# Altium schematic sheet TempSensors.SchDoc
size A4; SheetNumber: 6; SheetTotal: 12
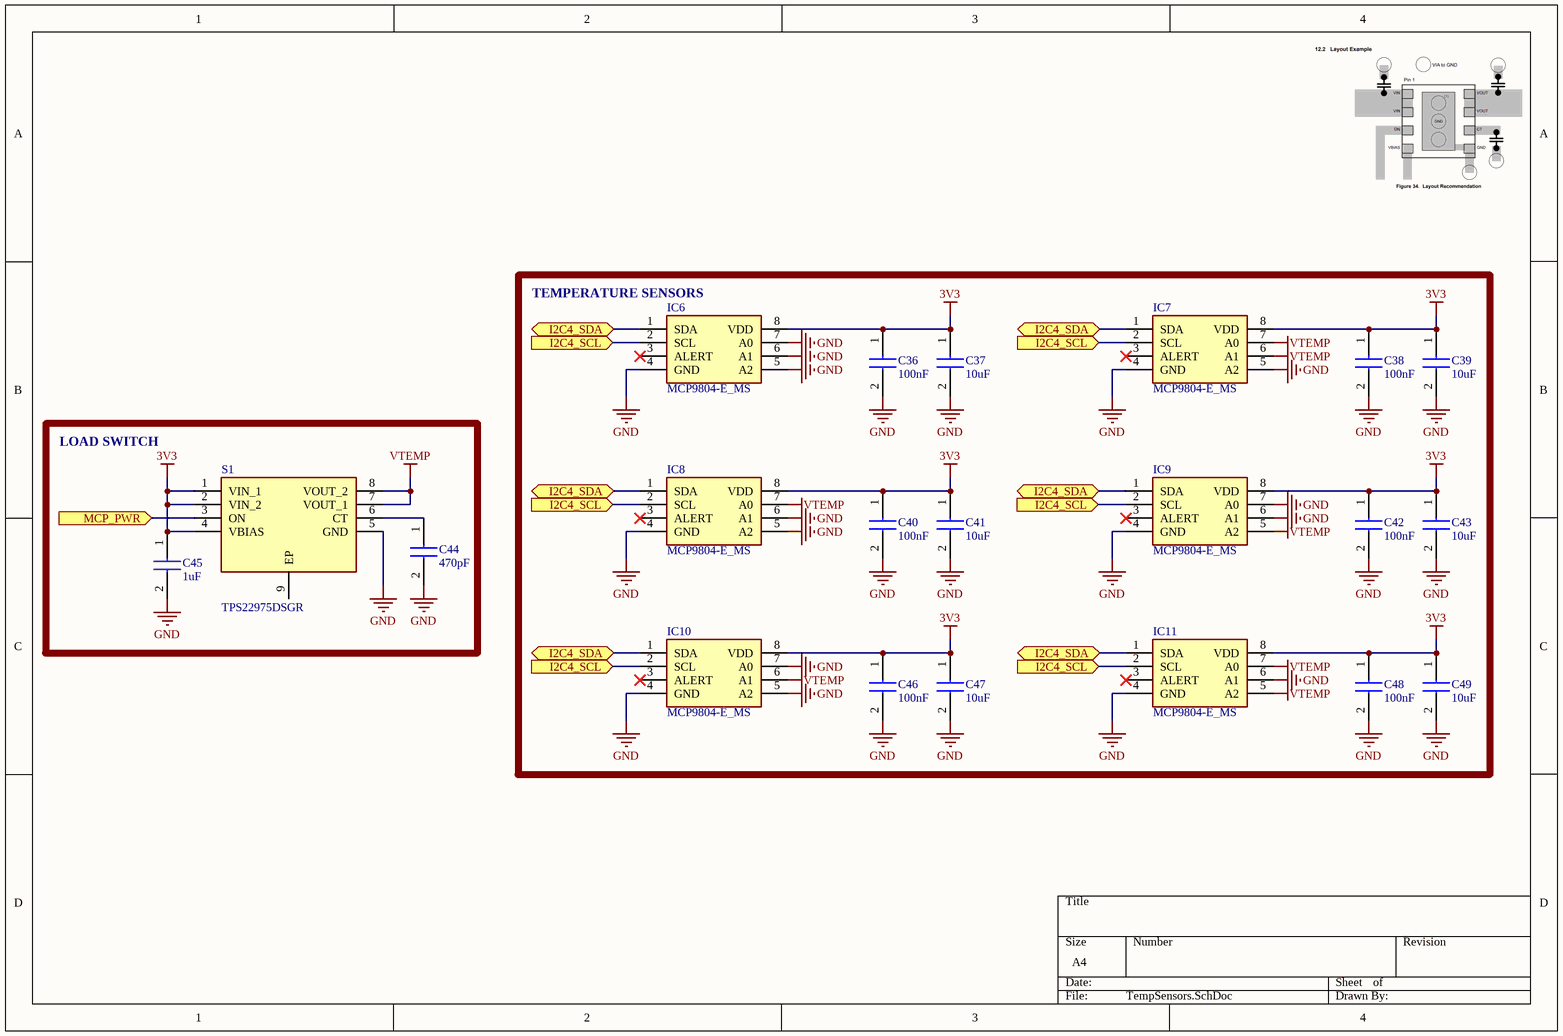
[diagram p0: TempSensors.SchDoc]

## Parts
C36  100nF  [CAPC1608X95N]
C37  10uF  [CAPC1608X90N]
C38  100nF  [CAPC1608X95N]
C39  10uF  [CAPC1608X90N]
C40  100nF  [CAPC1608X95N]
C41  10uF  [CAPC1608X90N]
C42  100nF  [CAPC1608X95N]
C43  10uF  [CAPC1608X90N]
C44  470pF  [CAPC1608X87N]
C45  1uF  [CAPC1608X90N]
C46  100nF  [CAPC1608X95N]
C47  10uF  [CAPC1608X90N]
C48  100nF  [CAPC1608X95N]
C49  10uF  [CAPC1608X90N]
IC6  MCP9804-E_MS  [SOP65P490X110-8N]
IC7  MCP9804-E_MS  [SOP65P490X110-8N]
IC8  MCP9804-E_MS  [SOP65P490X110-8N]
IC9  MCP9804-E_MS  [SOP65P490X110-8N]
IC10  MCP9804-E_MS  [SOP65P490X110-8N]
IC11  MCP9804-E_MS  [SOP65P490X110-8N]
S1  TPS22975DSGR  [SON50P200X200X80-9N]

## Blocks framed on the sheet
TEMPERATURE SENSORS: C36-C43 C46-C49 IC6-IC11
LOAD SWITCH: C44 C45 S1

## Ports
I2C4_SCL (in), I2C4_SDA (bidir), MCP_PWR (in)

## Nets
3V3: C36.1 C37.1 C38.1 C39.1 C40.1 C41.1 C42.1 C43.1 C45.1 C46.1 C47.1 C48.1 C49.1 IC6.8(VDD) IC7.8(VDD) IC8.8(VDD) IC9.8(VDD) IC10.8(VDD) IC11.8(VDD) S1.1(VIN_1) S1.2(VIN_2) S1.4(VBIAS)
GND: C36.2 C37.2 C38.2 C39.2 C40.2 C41.2 C42.2 C43.2 C44.2 C45.2 C46.2 C47.2 C48.2 C49.2 IC6.4(GND) IC6.5(A2) IC6.6(A1) IC6.7(A0) IC7.4(GND) IC7.5(A2) IC8.4(GND) IC8.5(A2) IC8.6(A1) IC9.4(GND) IC9.6(A1) IC9.7(A0) IC10.4(GND) IC10.5(A2) IC10.7(A0) IC11.4(GND) IC11.6(A1) S1.5(GND)
VTEMP: IC7.6(A1) IC7.7(A0) IC8.7(A0) IC9.5(A2) IC10.6(A1) IC11.5(A2) IC11.7(A0) S1.7(VOUT_1) S1.8(VOUT_2)
I2C4_SCL: IC6.2(SCL) IC7.2(SCL) IC8.2(SCL) IC10.2(SCL) IC11.2(SCL) ; port I2C4_SCL
I2C4_SDA: IC6.1(SDA) IC7.1(SDA) IC8.1(SDA) IC10.1(SDA) IC11.1(SDA) ; port I2C4_SDA
MCP_PWR: S1.3(ON) ; port MCP_PWR
NetC44_1: C44.1 S1.6(CT)

Not connected (* = marked no-connect by the designer): IC6 3(ALERT)*; IC7 3(ALERT)*; IC8 3(ALERT)*; IC9 1(SDA) 2(SCL) 3(ALERT)*; IC10 3(ALERT)*; IC11 3(ALERT)*; S1 9(EP)

## Library data of the parts
C36 C38 C40 C42 C46 C48 = C0603C104M4RAC7867: 0.1 µF ±20% 16V Ceramic Capacitor X7R 0603 (1608 Metric); Manufacturer_Name: KEMET; Datasheet Link: https://www.arrow.com/en/products/c0603c104m4rac7867/kemet-corporation?region=nac; Height: 0.95mm; Manufacturer_Part_Number: C0603C104M4RAC7867; Mouser Part Number: N/A; Mouser Price/Stock: https://www.mouser.co.uk/ProductDetail/KEMET/C0603C104M4RAC7867?qs=nAEW9fCjKd%252BI998RVtZhZQ%3D%3D; Arrow Part Number: C0603C104M4RAC7867; Arrow Price/Stock: https://www.arrow.com/en/products/c0603c104m4rac7867/kemet-corporation?region=europe
C37 C39 C41 C43 C47 C49 = GRM188D71A106KA73D: CAP CER 10UF 10V X7T 0603; Manufacturer_Name: Murata Electronics; Datasheet Link: https://psearch.en.murata.com/capacitor/product/GRM188D71A106KA73%23.html; Height: 0.9mm; Manufacturer_Part_Number: GRM188D71A106KA73D; Mouser Part Number: 81-GRM188D71A106KA3D; Mouser Price/Stock: https://www.mouser.co.uk/ProductDetail/Murata-Electronics/GRM188D71A106KA73D?qs=FvQ4nYu%252B2He2GIhYKxXmMQ%3D%3D; Arrow Part Number: GRM188D71A106KA73D; Arrow Price/Stock: https://www.arrow.com/en/products/grm188d71a106ka73d/murata-manufacturing?region=nac
C44 = 0603B471K500CT: CAP CER 470PF 50V X7R 0603; Manufacturer_Name: Walsin Technology Corporation; Datasheet Link: https://g.componentsearchengine.com/Datasheets/2/0603B471K500CT.pdf; Height: 0.87mm; Manufacturer_Part_Number: 0603B471K500CT; Arrow Part Number: 0603B471K500CT; Arrow Price/Stock: https://www.arrow.com/en/products/0603b471k500ct/walsin-technology
C45 = CL10A105KA8NNNC: 1 µF ±10% 25V Ceramic Capacitor X5R 0603 (1608 Metric); Manufacturer_Name: SAMSUNG; Datasheet Link: http://uk.rs-online.com/web/p/products/7664838; Height: 0.9mm; Manufacturer_Part_Number: CL10A105KA8NNNC; Mouser Part Number: 187-CL10A105KA8NNNC; Mouser Price/Stock: https://www.mouser.co.uk/ProductDetail/Samsung-Electro-Mechanics/CL10A105KA8NNNC?qs=hqM3L16%252BxldY%252BnK4KzDJVg%3D%3D; Arrow Part Number: CL10A105KA8NNNC; Arrow Price/Stock: https://www.arrow.com/en/products/cl10a105ka8nnnc/samsung-electro-mechanics?region=europe
IC6-IC11 = MCP9804-E_MS: Temperature Sensor Digital, Local -40°C ~ 125°C 10 b 8-MSOP; Manufacturer_Name: Microchip; Manufacturer_Part_Number: MCP9804-E/MS; Datasheet Link: http://ww1.microchip.com/downloads/en/DeviceDoc/22203C.pdf; Height: 1.1mm; Mouser Part Number: 579-MCP9804-E/MS; Mouser Price/Stock: https://www.mouser.co.uk/ProductDetail/Microchip-Technology-Atmel/MCP9804-E-MS?qs=AzWaBQTUlgwto0lQwcuMoQ%3D%3D; Arrow Part Number: MCP9804-E/MS; Arrow Price/Stock: https://www.arrow.com/en/products/mcp9804-ems/microchip-technology?region=nac
S1 = TPS22975DSGR: Power Switch/Driver 1:1 N-Channel 6A 8-WSON (2x2); Manufacturer_Name: Texas Instruments; Datasheet Link: http://www.ti.com/lit/gpn/tps22975; Height: 0.8mm; Manufacturer_Part_Number: TPS22975DSGR; Mouser Part Number: 595-TPS22975DSGR; Mouser Price/Stock: https://www.mouser.co.uk/ProductDetail/Texas-Instruments/TPS22975DSGR?qs=zEmsApcVOkXVZ0HZtWdfyQ%3D%3D; Arrow Part Number: TPS22975DSGR; Arrow Price/Stock: https://www.arrow.com/en/products/tps22975dsgr/texas-instruments?region=nac